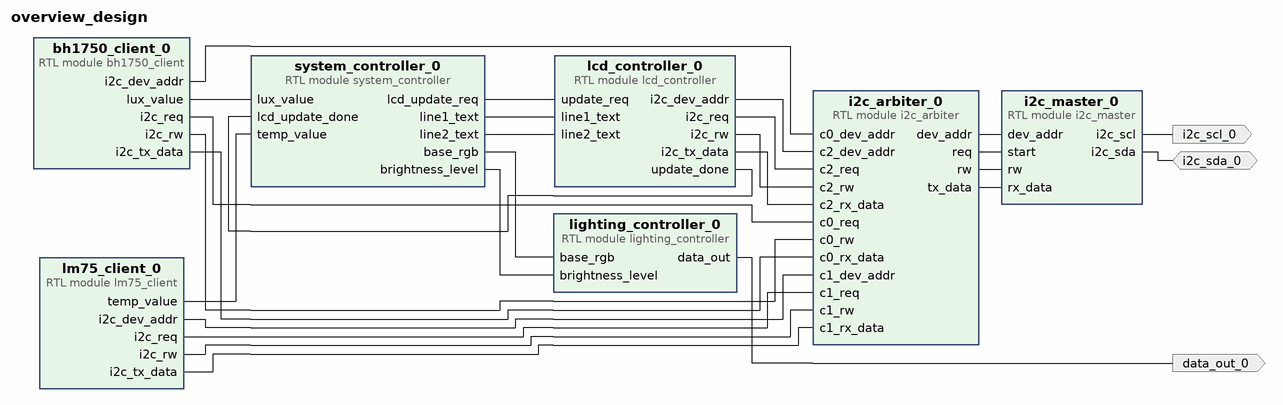
[diagram p0: block diagram of the top level]
# Vivado block design overview_design, xc7z020clg400-1, Vivado 2025.1
create_bd_design overview_design

create_bd_port -dir O i2c_scl_0
create_bd_port -dir IO i2c_sda_0
create_bd_port -dir O data_out_0

create_bd_cell -type module -reference bh1750_client bh1750_client_0
create_bd_cell -type module -reference i2c_arbiter i2c_arbiter_0
create_bd_cell -type module -reference lm75_client lm75_client_0
create_bd_cell -type module -reference lcd_controller lcd_controller_0
create_bd_cell -type module -reference i2c_master i2c_master_0
create_bd_cell -type module -reference lighting_controller lighting_controller_0
create_bd_cell -type module -reference system_controller system_controller_0

# ---- connections ----

connect_bd_net [get_bd_ports i2c_sda_0] [get_bd_pins i2c_master_0/i2c_sda]
connect_bd_net [get_bd_pins bh1750_client_0/i2c_dev_addr] [get_bd_pins i2c_arbiter_0/c0_dev_addr]
connect_bd_net [get_bd_pins bh1750_client_0/i2c_req] [get_bd_pins i2c_arbiter_0/c0_req]
connect_bd_net [get_bd_pins bh1750_client_0/i2c_rw] [get_bd_pins i2c_arbiter_0/c0_rw]
connect_bd_net [get_bd_pins bh1750_client_0/i2c_tx_data] [get_bd_pins i2c_arbiter_0/c0_rx_data]
connect_bd_net [get_bd_pins bh1750_client_0/lux_value] [get_bd_pins system_controller_0/lux_value]
connect_bd_net [get_bd_pins i2c_arbiter_0/dev_addr] [get_bd_pins i2c_master_0/dev_addr]
connect_bd_net [get_bd_pins i2c_arbiter_0/req] [get_bd_pins i2c_master_0/start]
connect_bd_net [get_bd_pins i2c_arbiter_0/rw] [get_bd_pins i2c_master_0/rw]
connect_bd_net [get_bd_pins i2c_arbiter_0/tx_data] [get_bd_pins i2c_master_0/rx_data]
connect_bd_net -net i2c_master_0_i2c_scl [get_bd_ports i2c_scl_0] [get_bd_pins i2c_master_0/i2c_scl]
connect_bd_net [get_bd_pins lcd_controller_0/i2c_dev_addr] [get_bd_pins i2c_arbiter_0/c2_dev_addr]
connect_bd_net [get_bd_pins lcd_controller_0/i2c_req] [get_bd_pins i2c_arbiter_0/c2_req]
connect_bd_net [get_bd_pins lcd_controller_0/i2c_rw] [get_bd_pins i2c_arbiter_0/c2_rw]
connect_bd_net [get_bd_pins lcd_controller_0/i2c_tx_data] [get_bd_pins i2c_arbiter_0/c2_rx_data]
connect_bd_net [get_bd_pins lcd_controller_0/update_done] [get_bd_pins system_controller_0/lcd_update_done]
connect_bd_net [get_bd_pins lighting_controller_0/data_out] [get_bd_ports data_out_0]
connect_bd_net [get_bd_pins lm75_client_0/i2c_dev_addr] [get_bd_pins i2c_arbiter_0/c1_dev_addr]
connect_bd_net [get_bd_pins lm75_client_0/i2c_req] [get_bd_pins i2c_arbiter_0/c1_req]
connect_bd_net [get_bd_pins lm75_client_0/i2c_rw] [get_bd_pins i2c_arbiter_0/c1_rw]
connect_bd_net [get_bd_pins lm75_client_0/i2c_tx_data] [get_bd_pins i2c_arbiter_0/c1_rx_data]
connect_bd_net [get_bd_pins lm75_client_0/temp_value] [get_bd_pins system_controller_0/temp_value]
connect_bd_net [get_bd_pins system_controller_0/base_rgb] [get_bd_pins lighting_controller_0/base_rgb]
connect_bd_net [get_bd_pins system_controller_0/brightness_level] [get_bd_pins lighting_controller_0/brightness_level]
connect_bd_net [get_bd_pins system_controller_0/lcd_update_req] [get_bd_pins lcd_controller_0/update_req]
connect_bd_net [get_bd_pins system_controller_0/line1_text] [get_bd_pins lcd_controller_0/line1_text]
connect_bd_net [get_bd_pins system_controller_0/line2_text] [get_bd_pins lcd_controller_0/line2_text]

validate_bd_design
save_bd_design
